# EAGLE schematic WZ8048C070-V1.1-20230407 (EAGLE 9.6.2)
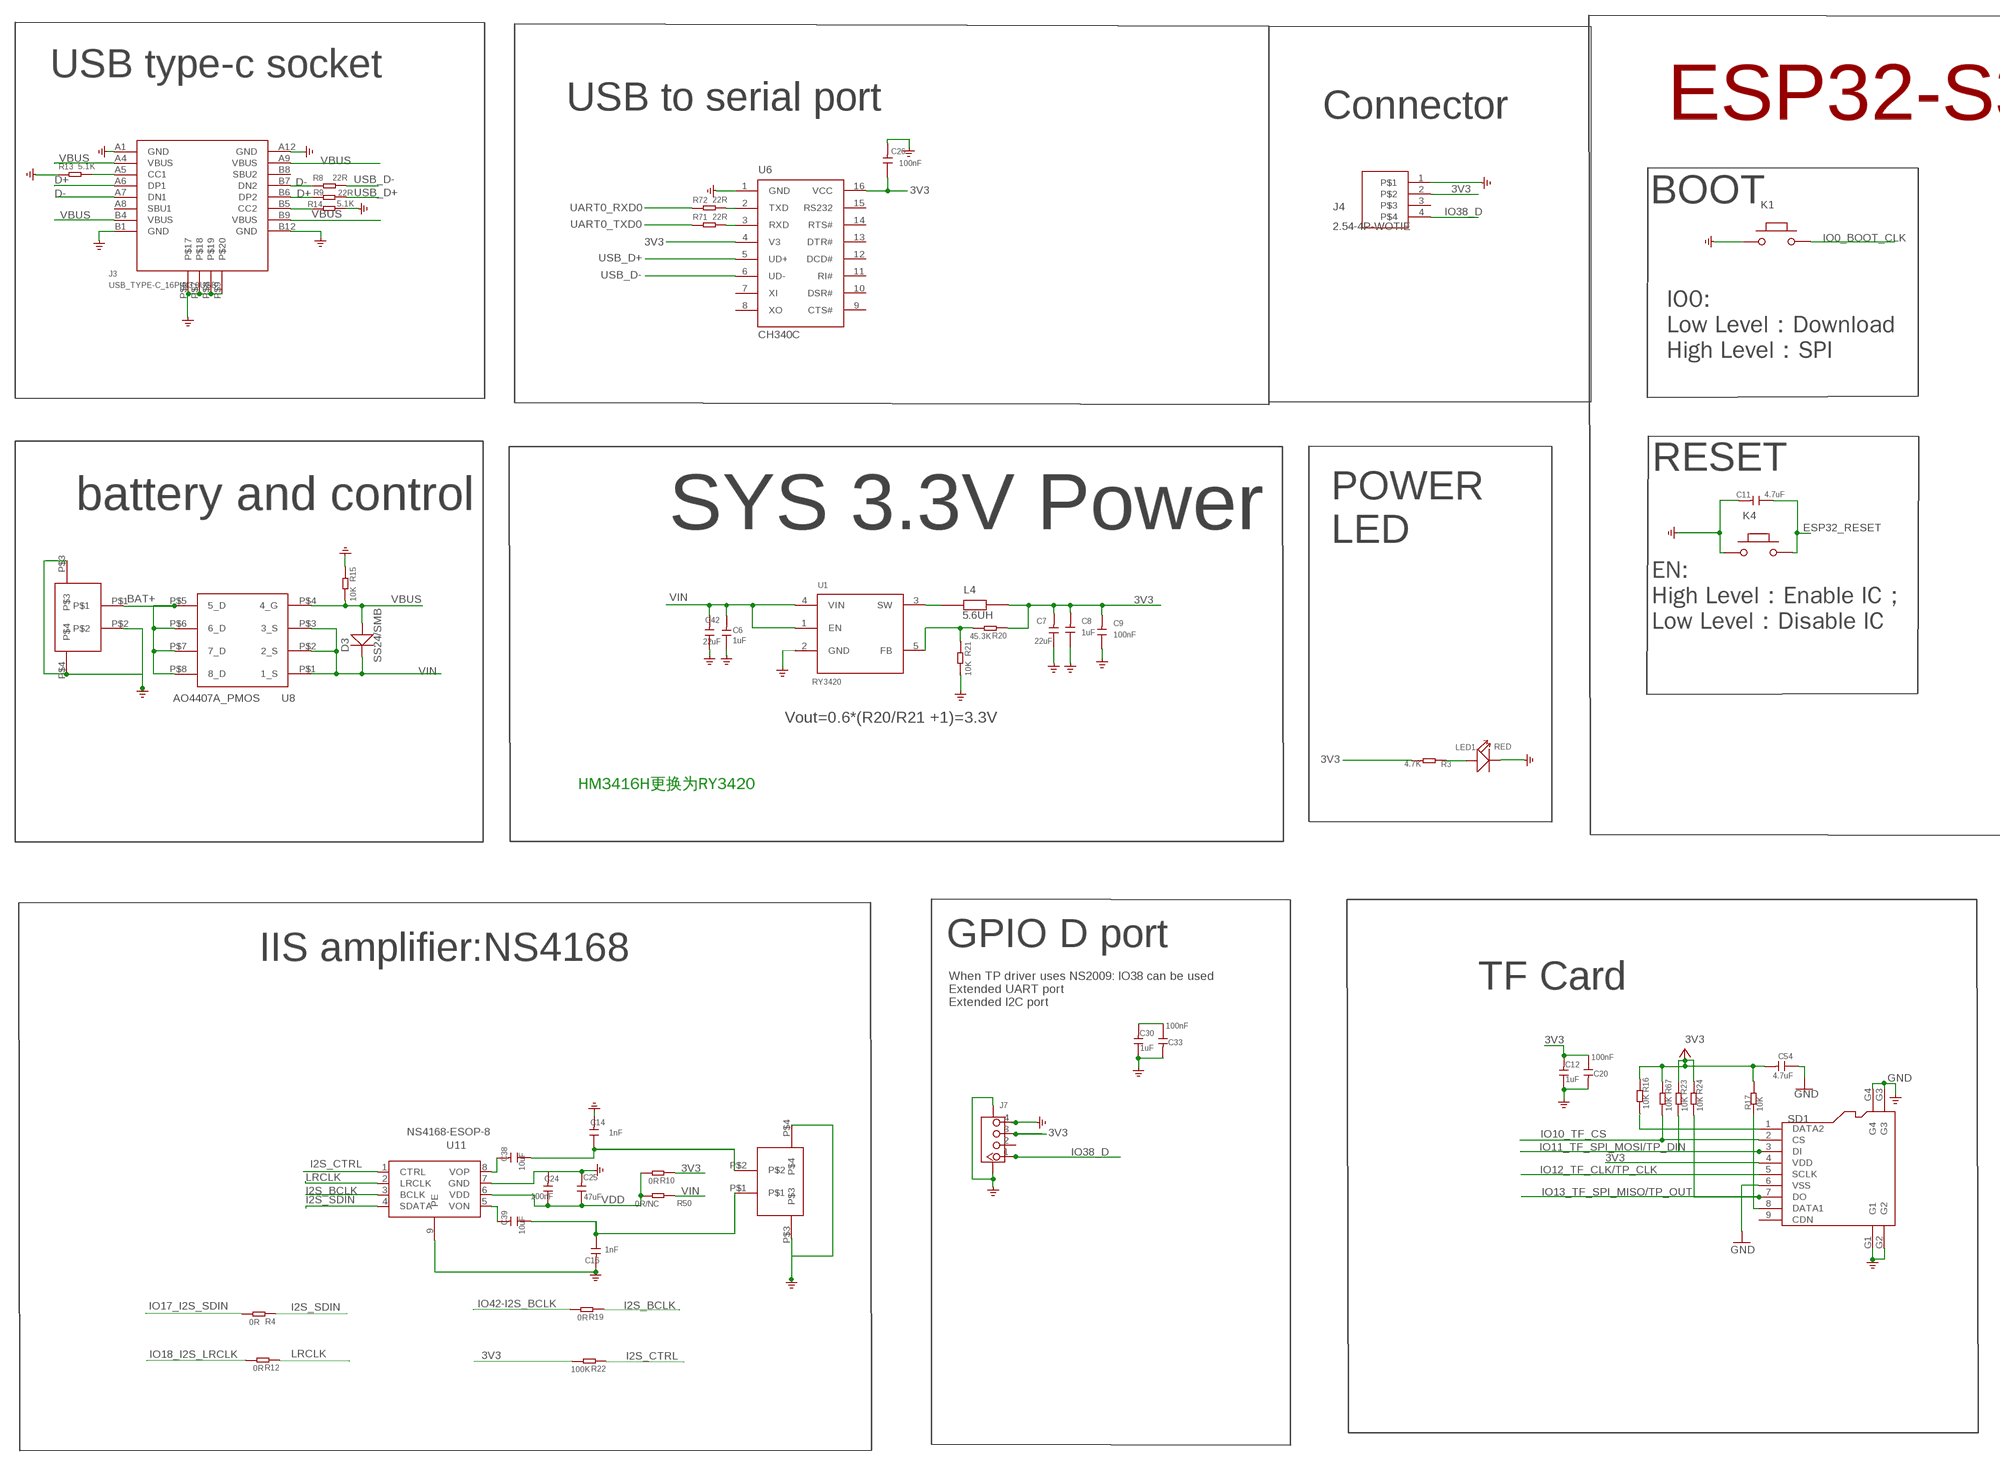
[diagram p0: schematic, sheet 1, part 1 of 2]
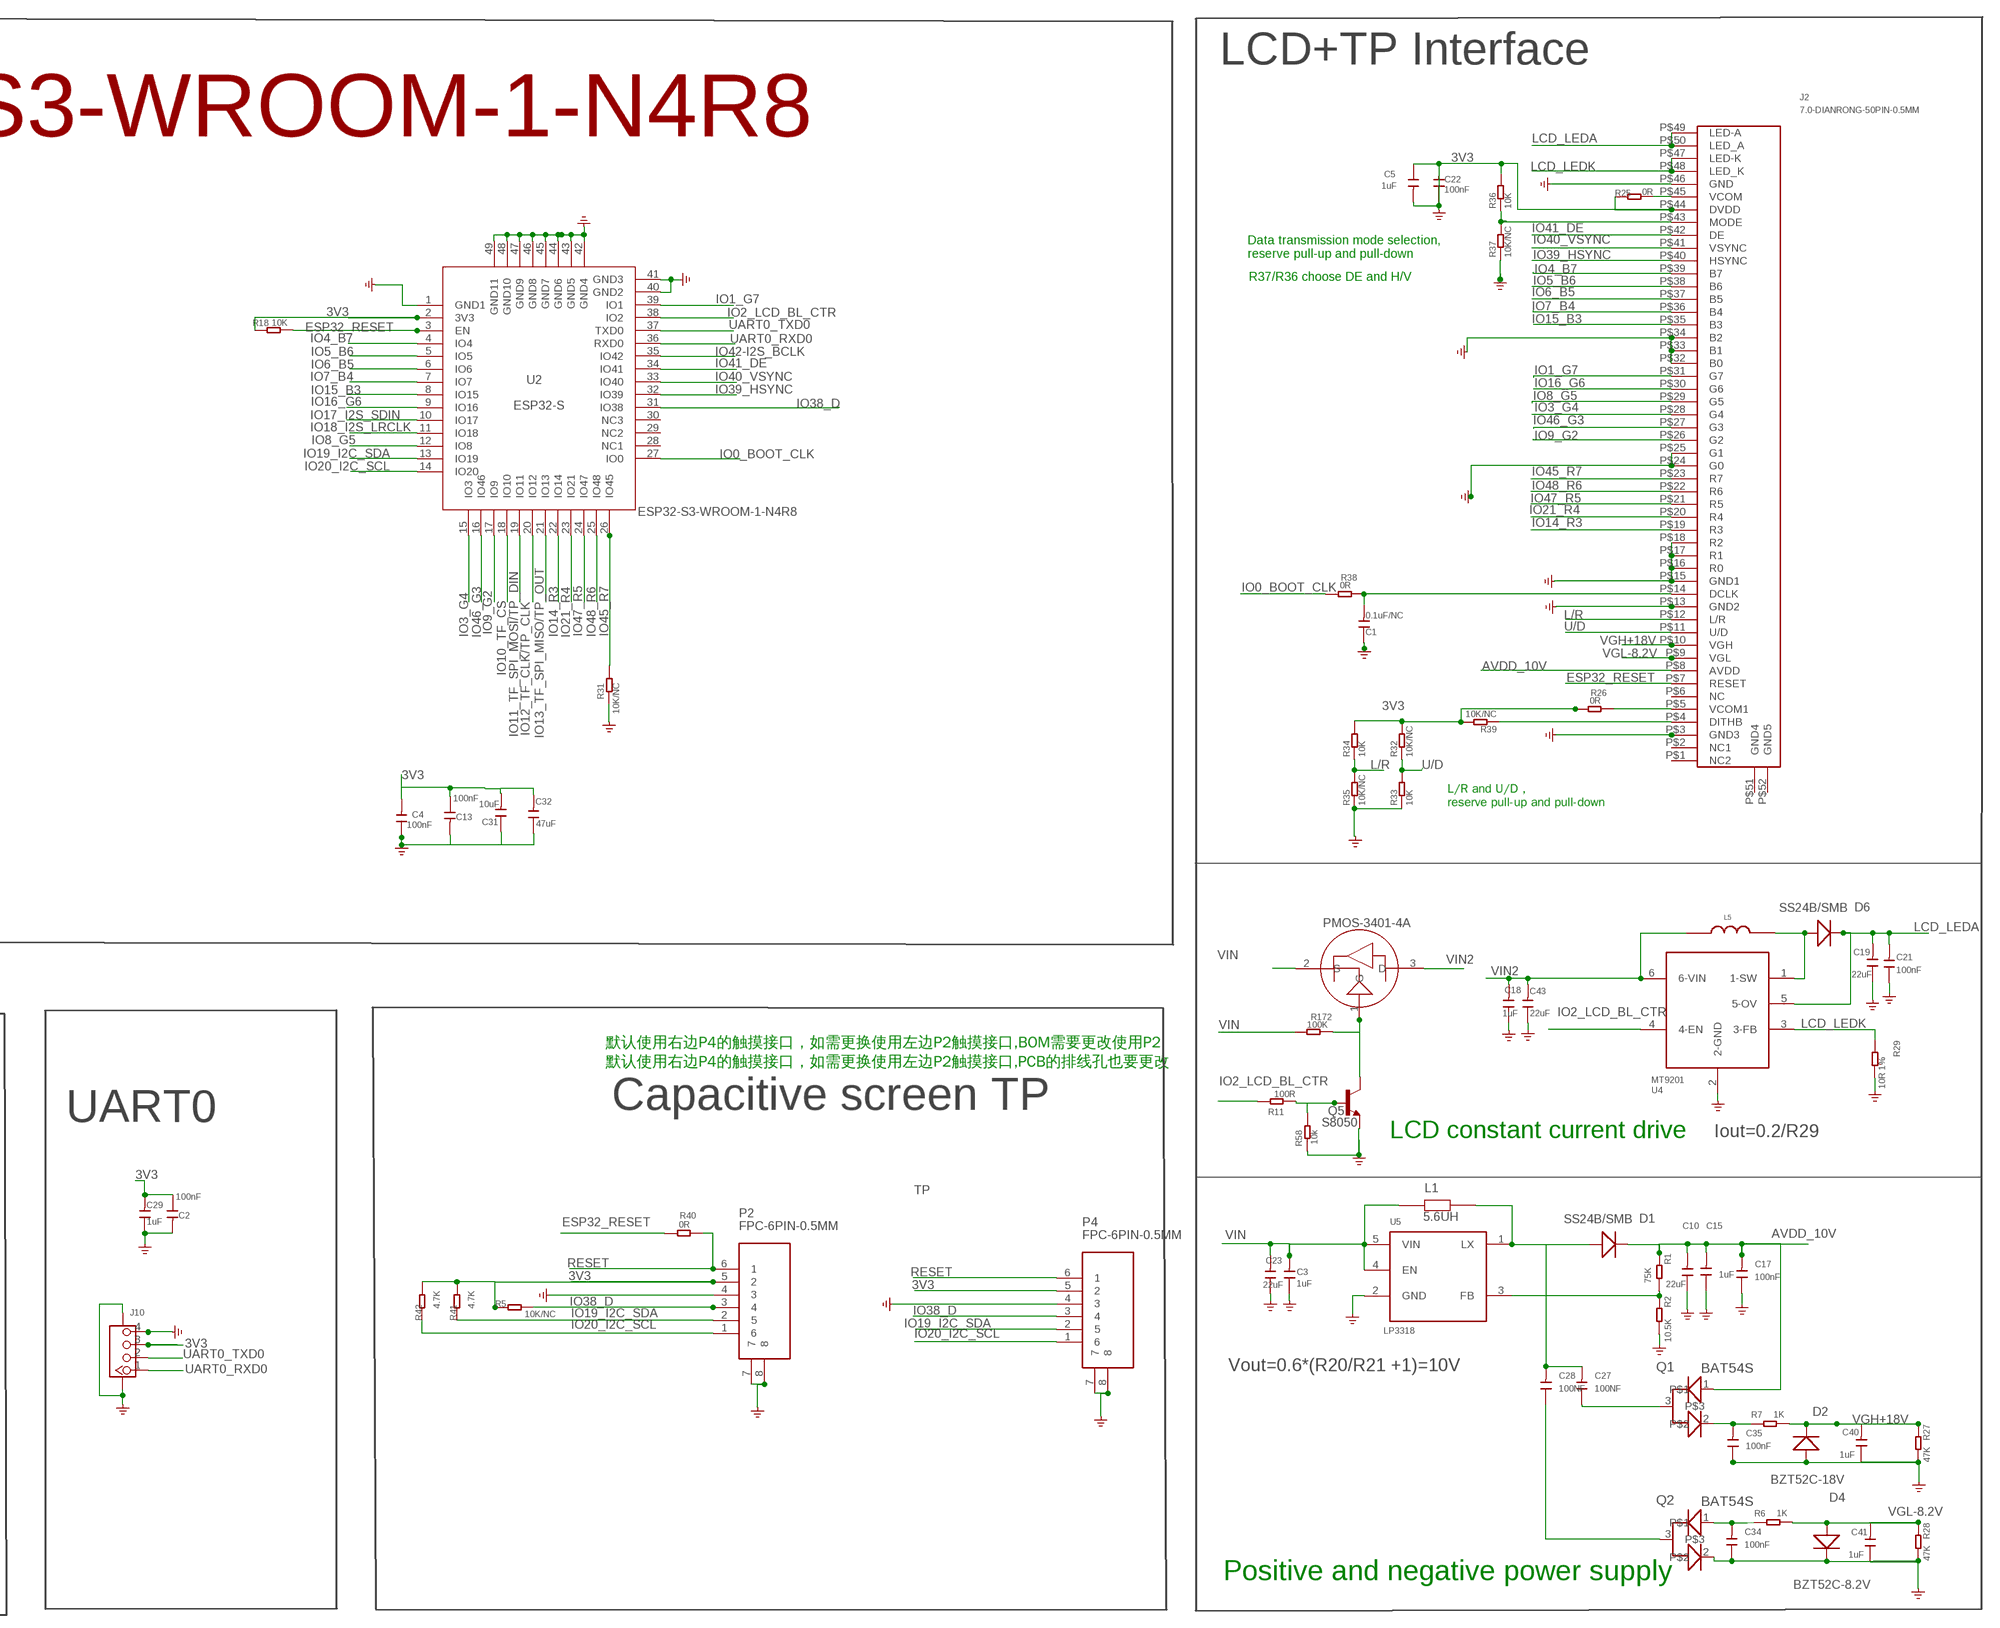
[diagram p1: schematic, sheet 1, part 2 of 2]

## Parts
C1  0.1uF/NC  DISCRETE_C-0603  [DISCRETE_C0603]
C2  100nF  C-0603  [C0603]
C3  1uF  C0603  [0603]
C4  100nF  C-0603  [C0603]
C5  1uF  C-0603  [C0603]
C6  1uF  C0603  [0603]
C7  22uF  C0805  [0805]
C8  1uF  C0603  [0603]
C9  100nF  C0603  [0603]
C10  22uF  C0805  [0805]
C11  4.7uF  C0603  [0603]
C12  1uF  DISCRETE_C-0603  [DISCRETE_C0603]
C13  100nF  C-0603  [C0603]
C14  1nF  C-0603  [C0603]
C15  1uF  C0603  [0603]
C16  1nF  C-0603  [C0603]
C17  100nF  C0603  [0603]
C18  1uF  C0603  [0603]
C19  22uF  C0805  [0805]
C20  100nF  C-0603  [C0603]
C21  100nF  C0603  [0603]
C22  100nF  C-0603  [C0603]
C23  22uF  C0805  [0805]
C24  100nF  C-0603  [C0603]
C25  47uF  C0805  [0805]
C26  100nF  C0603  [0603]
C27  100NF  C0603  [0603]
C28  100NF  C0603  [0603]
C29  1uF  DISCRETE_C-0603  [DISCRETE_C0603]
C30  1uF  DISCRETE_C-0603  [DISCRETE_C0603]
C31  10uF  DISCRETE_C-0603  [DISCRETE_C0603]
C32  47uF  C0805  [0805]
C33  100nF  C-0603  [C0603]
C34  100nF  C0603  [0603]
C35  100nF  C0603  [0603]
C38  10uF  C-0603  [C0603]
C39  10uF  C-0603  [C0603]
C40  1uF  C0805  [0805]
C41  1uF  C0805  [0805]
C42  22uF  C0805  [0805]
C43  22uF  C0805  [0805]
C54  4.7uF  DISCRETE_C-0603  [DISCRETE_C0603]
D1  SS24B/SMB  214ABDO-214AB  [214AB]
D2  BZT52C-18V  DISCRETE_D1206  [DISCRETE_SOD123]
D3  SS24/SMB  214ABDO-214AB  [214AB]
D4  BZT52C-8.2V  DISCRETE_D1206  [DISCRETE_SOD123]
D6  SS24B/SMB  214ABDO-214AB  [214AB]
J1  PH2.0WT-2PIN  [PH2.0WT-2PIN]
J2  7.0-DIANRONG-50PIN-0.5MM  [7.0-DAINRONG-50PIN-0.5MM]
J3  USB_TYPE-C_16PIN3.0USB  [KEVIN_3.0TYPEC-SMD]
J4  2.54-4P-WOTIE  [2.54-4P-WOTIE]
J5  PH2.0WT-2PIN  [PH2.0WT-2PIN]
J7  CONNECTOR_TWIG-4P-2.0-SMD-FEMALE-REINFORCE90D  [CONNECTOR_4P-SMD-2.0-90D]
J10  CONNECTOR_TWIG-4P-2.0-SMD-FEMALE-REINFORCE90D  [CONNECTOR_4P-SMD-2.0-90D]
K1  BUTTON  PB157  [157SW]
K4  BUTTON  PB157  [157SW]
L1  5.6UH  CROWPI2-MB-V1.4-20211012_CMP201209UD1R0MT  [CD54]
L4  5.6UH  CROWPI2-MB-V1.4-20211012_CMP201209UD1R0MT  [CD54]
L5  CD32_6.8uH  CD32_950MA  [CD32]
LED1  RED  DISCRETE_LED0603  [DISCRETE_LED-0603]
P2  FPC-6PIN-0.5MM  [FPC-6PIN-0.5MM]
P4  FPC-6PIN-0.5MM  [FPC-6PIN-0.5MM]
Q1  BAT54S  [SOT23-3]
Q2  BAT54S  [SOT23-3]
Q5  S8050  SPARKFUN_TRANSISTOR_NPNSOT23  [SPARKFUN_SOT23]
Q30  PMOS-3401-4A  P-MOS-SOT23  [SOT-23]
R1  75K  DISCRETE_R-0603  [DISCRETE_R0603]
R2  10.5K  DISCRETE_R-0603  [DISCRETE_R0603]
R3  4.7K  DISCRETE_R-0603  [DISCRETE_R0603]
R4  0R  DISCRETE_R-0603  [DISCRETE_R0603]
R5  10K/NC  DISCRETE_R-0603  [DISCRETE_R0603]
R6  1K  DISCRETE_R-0603  [DISCRETE_R0603]
R7  1K  DISCRETE_R-0603  [DISCRETE_R0603]
R8  22R  DISCRETE_R-0603  [DISCRETE_R0603]
R9  22R  DISCRETE_R-0603  [DISCRETE_R0603]
R10  0R  DISCRETE_R-0603  [DISCRETE_R0603]
R11  100R  R0603  [R0603]
R12  0R  DISCRETE_R-0603  [DISCRETE_R0603]
R13  5.1K  DISCRETE_R-0603  [DISCRETE_R0603]
R14  5.1K  DISCRETE_R-0603  [DISCRETE_R0603]
R15  10K  DISCRETE_R-0603  [DISCRETE_R0603]
R16  10K  DISCRETE_R-0603  [DISCRETE_R0603]
R17  10K  DISCRETE_R-0603  [DISCRETE_R0603]
R18  10K  DISCRETE_R-0603  [DISCRETE_R0603]
R19  0R  DISCRETE_R-0603  [DISCRETE_R0603]
R20  45.3K  DISCRETE_R-0603  [DISCRETE_R0603]
R21  10K  DISCRETE_R-0603  [DISCRETE_R0603]
R22  100K  DISCRETE_R-0603  [DISCRETE_R0603]
R23  10K  DISCRETE_R-0603  [DISCRETE_R0603]
R24  10K  DISCRETE_R-0603  [DISCRETE_R0603]
R25  0R  DISCRETE_R-0603  [DISCRETE_R0603]
R26  0R  R-0603  [R0603]
R27  47K  DISCRETE_R-0603  [DISCRETE_R0603]
R28  47K  DISCRETE_R-0603  [DISCRETE_R0603]
R29  10R 1%  DISCRETE_R-0603  [DISCRETE_R0603]
R31  10K/NC  R0603  [R0603]
R32  10K/NC  DISCRETE_R-0603  [DISCRETE_R0603]
R33  10K  DISCRETE_R-0603  [DISCRETE_R0603]
R34  10K  DISCRETE_R-0603  [DISCRETE_R0603]
R35  10K/NC  DISCRETE_R-0603  [DISCRETE_R0603]
R36  10K  DISCRETE_R-0603  [DISCRETE_R0603]
R37  10K/NC  DISCRETE_R-0603  [DISCRETE_R0603]
R38  0R  R-0603  [R0603]
R39  10K/NC  DISCRETE_R-0603  [DISCRETE_R0603]
R40  0R  R-0603  [R0603]
R41  4.7K  DISCRETE_R-0603  [DISCRETE_R0603]
R42  4.7K  DISCRETE_R-0603  [DISCRETE_R0603]
R50  0R/NC  DISCRETE_R-0603  [DISCRETE_R0603]
R58  10k  R0603  [R0603]
R67  10K  DISCRETE_R-0603  [DISCRETE_R0603]
R71  22R  DISCRETE_R-0603  [DISCRETE_R0603]
R72  22R  DISCRETE_R-0603  [DISCRETE_R0603]
R172  100K  R-0603  [R0603]
SD1  HOLDER-MICROSD-9P  [9P-SMD-W/-RING]
U1  RY3420  A_XBJ_HM3420B  [A_XBJ_SOT23-5]
U2  ESP32-S  [ESP32-S3]
U4  MT9201  [SOT23-6]
U5  LP3318  [LP3318_SOT23-5]
U6  CH340C  CH340G  [SOP-16]
U8  AO4407A_PMOS  T_PMOS_AO4407A_SOP8  [SOP8]
U11  NS4168-ESOP-8  [NS4168-ESOP-8]

## Nets
3V3: C2.1 C4.2 C5.1 C7.2 C8.2 C9.2 C12.2 C13.1 C20.1 C22.2 C26.1 C29.2 C30.2 C31.2 C32.2 C33.1 C54.2 J2.P$44(DVDD) J4.2 J7.3 J10.3 L4.2 P2.5 P4.5 R3.2 R5.1 R10.1 R16.1 R17.1 R18.1 R20.1 R22.2 R23.1 R24.1 R25.1 R26.1 R32.2 R34.2 R36.2 R39.2 R41.2 R42.2 R67.1 SD1.4(VDD) U2.2(3V3) U6.4(V3) U6.16(VCC) ; supply symbol labelled +3V3
AVDD_10V: C10.2 C15.2 C17.2 D1.2(-) J2.P$8(AVDD) Q1.1 R1.1
BAT+: J1.P$1 U8.P$5(5_D) U8.P$6(6_D) U8.P$7(7_D) U8.P$8(8_D)
D+: J3.A6(DP1) J3.B6(DP2) R9.1
D-: J3.A7(DN1) J3.B7(DN2) R8.1
DCLK1: C1.2 J2.P$14(DCLK) R38.2
ESP32_RESET: C11.1 J2.P$7(RESET) K4.2 R18.2 R40.1 U2.3(EN)
GND: C1.1 C2.2 C3.1 C4.1 C5.2 C6.1 C7.1 C8.1 C9.1 C10.1 C11.2 C12.1 C13.2 C14.2 C15.1 C16.2 C17.1 C18.1 C19.1 C20.2 C21.1 C22.1 C23.1 C24.2 C25.2 C26.2 C29.1 C30.1 C31.1 C32.1 C33.2 C34.1 C35.1 C40.1 C41.1 C42.1 C43.1 C54.1 D2.+ D4.- J1.P$2 J1.P$3 J1.P$4 J2.P$3(GND3) J2.P$13(GND2) J2.P$15(GND1) J2.P$16(R0) J2.P$17(R1) J2.P$18(R2) J2.P$24(G0) J2.P$25(G1) J2.P$32(B0) J2.P$33(B1) J2.P$34(B2) J2.P$46(GND) J3.A1(GND) J3.A12(GND) J3.B1(GND) J3.B12(GND) J3.P$6 J3.P$7 J3.P$8 J3.P$9 J4.1 J5.P$3 J5.P$4 J7.4 J7.SS1 J7.SS2 J10.4 J10.SS1 J10.SS2 K1.1 K4.1 LED1.- P2.4 P2.7 P2.8 P4.4 P4.7 P4.8 Q2.2 Q5.2(E) R2.2 R13.1 R14.2 R15.1 R21.2 R27.2 R28.2 R29.2 R31.1 R33.1 R35.1 R37.1 R58.1 SD1.6(VSS) SD1.G1 SD1.G2 SD1.G3 SD1.G4 U1.2(GND) U2.1(GND1) U2.40(GND2) U2.41(GND3) U2.42(GND4) U2.43(GND5) U2.44(GND6) U2.45(GND7) U2.46(GND8) U2.47(GND9) U2.48(GND10) U2.49(GND11) U4.2(2-GND) U5.2(GND) U6.1(GND) U11.7(GND) U11.9(PE)
I2S_BCLK: R19.1 U11.3(BCLK)
I2S_CTRL: R22.1 U11.1(CTRL)
I2S_SDIN: R4.1 U11.4(SDATA)
IO0_BOOT_CLK: K1.2 R38.1 U2.27(IO0)
IO1_G7: J2.P$31(G7) U2.39(IO1)
IO2_LCD_BL_CTR: R11.2 U2.38(IO2) U4.4(4-EN)
IO3_G4: J2.P$28(G4) U2.15(IO3)
IO4_B7: J2.P$39(B7) U2.4(IO4)
IO5_B6: J2.P$38(B6) U2.5(IO5)
IO6_B5: J2.P$37(B5) U2.6(IO6)
IO7_B4: J2.P$36(B4) U2.7(IO7)
IO8_G5: J2.P$29(G5) U2.12(IO8)
IO9_G2: J2.P$26(G2) U2.17(IO9)
IO10_TF_CS: R67.2 SD1.2(CS) U2.18(IO10)
IO11_TF_SPI_MOSI/TP_DIN: R23.2 SD1.3(DI) U2.19(IO11)
IO12_TF_CLK/TP_CLK: SD1.5(SCLK) U2.20(IO12)
IO13_TF_SPI_MISO/TP_OUT: R24.2 SD1.7(DO) U2.21(IO13)
IO14_R3: J2.P$19(R3) U2.22(IO14)
IO15_B3: J2.P$35(B3) U2.8(IO15)
IO16_G6: J2.P$30(G6) U2.9(IO16)
IO17_I2S_SDIN: R4.2 U2.10(IO17)
IO18_I2S_LRCLK: R12.2 U2.11(IO18)
IO19_I2C_SDA: P2.2 P4.2 R41.1 U2.13(IO19)
IO20_I2C_SCL: P2.1 P4.1 R42.1 U2.14(IO20)
IO21_R4: J2.P$20(R4) U2.23(IO21)
IO38_D: J4.4 J7.1 P2.3 P4.3 R5.2 U2.31(IO38)
IO39_HSYNC: J2.P$40(HSYNC) U2.32(IO39)
IO40_VSYNC: J2.P$41(VSYNC) U2.33(IO40)
IO41_DE: J2.P$42(DE) U2.34(IO41)
IO42-I2S_BCLK: R19.2 U2.35(IO42)
IO45_R7: J2.P$23(R7) R31.2 U2.26(IO45)
IO46_G3: J2.P$27(G3) U2.16(IO46)
IO47_R5: J2.P$21(R5) U2.24(IO47)
IO48_R6: J2.P$22(R6) U2.25(IO48)
L/R: J2.P$12(L/R) R34.1 R35.2
LCD_LEDA: C19.2 C21.2 D6.2(-) J2.P$49(LED-A) J2.P$50(LED_A) U4.5(5-OV)
LCD_LEDK: J2.P$47(LED-K) J2.P$48(LED_K) R29.1 U4.3(3-FB)
LRCLK: R12.1 U11.2(LRCLK)
N$1: LED1.+ R3.1
N$2: J2.P$45(VCOM) R25.2
N$3: C14.1 C38.1 J5.P$2
N$4: J2.P$5(VCOM1) R26.2
N$6: C38.2 U11.8(VOP)
N$7: R1.2 R2.1 U5.3(FB)
N$8: C39.2 U11.5(VON)
N$9: C27.2 C28.2 D1.1(+) L1.2 U5.1(LX)
N$10: C27.1 Q1.3
N$11: J3.A5(CC1) R13.2
N$12: J2.P$43(MODE) R36.1 R37.2
N$13: L4.1 U1.3(SW)
N$14: J2.P$4(DITHB) R39.1
N$15: C16.1 C39.1 J5.P$1
N$16: D6.1(+) L5.2 U4.1(1-SW)
N$17: J3.B5(CC2) R14.1
N$20: R20.2 R21.1 U1.5(FB)
N$23: Q5.1(B) R11.1 R58.2
N$24: C28.1 Q2.3
N$29: C35.2 Q1.2 R7.1
N$30: C34.2 Q2.1 R6.1
N$36: Q5.3(C) Q30.1(G) R172.2
N$40: R72.2 U6.2(TXD)
N$42: R71.2 U6.3(RXD)
N$47: R16.2 SD1.1(DATA2)
N$48: R17.2 SD1.8(DATA1)
RESET: P2.6 P4.6 R40.2
U/D: J2.P$11(U/D) R32.1 R33.2
UART0_RXD0: J10.1 R72.1 U2.36(RXD0)
UART0_TXD0: J10.2 R71.1 U2.37(TXD0)
USB_D+: R9.2 U6.5(UD+)
USB_D-: R8.2 U6.6(UD-)
VBUS: D3.1(+) J3.A4(VBUS) J3.A9(VBUS) J3.B4(VBUS) J3.B9(VBUS) R15.2 U8.P$4(4_G)
VDD: C24.1 C25.1 R10.2 R50.2 U11.6(VDD)
VGH+18V: C40.2 D2.- J2.P$10(VGH) R7.2 R27.1
VGL-8.2V: C41.2 D4.+ J2.P$9(VGL) R6.2 R28.1
VIN: C3.2 C6.2 C23.2 C42.2 D3.2(-) L1.1 Q30.2(S) R50.1 R172.1 U1.1(EN) U1.4(VIN) U5.4(EN) U5.5(VIN) U8.P$1(1_S) U8.P$2(2_S) U8.P$3(3_S)
VIN2: C18.2 C43.2 L5.1 Q30.3(D) U4.6(6-VIN)
Unconnected: J2.P$1(NC2) J2.P$2(NC1) J2.P$6(NC) J2.P$51(GND4) J2.P$52(GND5) J3.A8(SBU1) J3.B8(SBU2) J4.3 J7.2 SD1.9(CDN) U2.28(NC1) U2.29(NC2) U2.30(NC3) U6.7(XI) U6.8(XO) U6.9(CTS#) U6.10(DSR#) U6.11(RI#) U6.12(DCD#) U6.13(DTR#) U6.14(RTS#) U6.15(RS232)

## Notes on the sheet
- LCD+TP Interface
- USB type-c socket
- USB to serial port | Connector | ESP32-S3-WROOM-1-N4R8
- BOOT
- Data transmission mode selection, 
  reserve pull-up and pull-down
- R37/R36 choose DE and H/V
- IO0:
  Low Level：Download
  High Level：SPI
- RESET
- battery and control
- SYS 3.3V Power
- POWER
  LED
- EN:
  High Level：Enable IC；
  Low Level：Disable IC
- L/R and U/D，
  reserve pull-up and pull-down
- Vout=0.6*(R20/R21 +1)=3.3V
- HM3416H更换为RY3420
- 默认使用右边P4的触摸接口，如需更换使用左边P2触摸接口,BOM需要更改使用P2
- GPIO D port | 默认使用右边P4的触摸接口，如需更换使用左边P2触摸接口,PCB的排线孔也要更改
- IIS amplifier:NS4168
- TF Card | UART0 | Capacitive screen TP
- When TP driver uses NS2009: IO38 can be used
  Extended UART port
  Extended I2C port
- LCD constant current drive | Iout=0.2/R29
- TP
- Vout=0.6*(R20/R21 +1)=10V
- Positive and negative power supply

## Library data of the parts
C1 C31 C54 = A9G:DISCRETE_C*: Ceramic Capacitors
C2 C4 C5 C13 C14 C16 C20 C22 C24 C33 C38 C39 = discrete:C*: Ceramic Capacitors
C3 C6 C8 C9 C11 C15 C17 C18 C21 C26-C28 C34 C35 = A_xbj:C0603
C7 C10 C19 C23 C25 C32 C40-C43 = A_xbj:C0805
C12 C29 C30 = A_xbj:DISCRETE_C*: Ceramic Capacitors
D1 D3 D6 = DO-214AB:214AB: 214AB
D2 D4 = cooper:DISCRETE_D*
J1 J5 = cooper:PH2.0WT-2PIN
J2 = cooper:7.0-DIANRONG-50PIN-0.5MM
J3 = WZ3532R024-ESP32-V0.1-20221226:USB_TYPE-C_16PIN
J4 = cooper:2.54-4P-WOTIE
J7 J10 = A_xbj:CONNECTOR_TWIG-4P-2.0-SMD-FEMALE-REINFORCE
K1 K4 = MySMD:PB157
L1 L4 = CD54:CROWPI2-MB-V1.4-20211012_CMP201209UD1R0MT
L5 = CD54:CD32_950MA
LED1 = A_xbj:DISCRETE_LED*
P2 P4 = cooper:FPC-6PIN-0.5MM
Q1 Q2 = cooper:BAT54S
Q5 = Adafruit_HUZZAH32_ESP32_Feather:SPARKFUN_TRANSISTOR_NPN: Transistor NPN BJT configuration in SOT23 package. MMBT2222 is the common NPN we use. Double check BCE configuration again layout.
Q30 = DFN8:P-MOS-SOT23
R1-R10 R12-R25 R27-R29 R41 R42 R50 R67 R71 R72 = Crowtail-_LED-V2.0-20190615-01:DISCRETE_R*
R11 R31 R58 = cooper:R0603
R26 R38 R40 R172 = discrete:R*
R32-R37 R39 = A9G:DISCRETE_R*
SD1 = Connector:HOLDER-MICROSD-9P
U1 = CrowBot_-V1.0-20220525:A_XBJ_HM3420B
U2 = DW1000:ESP32-S; U2: ESP32-S3-WROOM-1-N4R8
U4 = cooper:MT9201
U5 = cooper:LP3318
U6 = A_xbj:CH340G
U8 = cooper:T_PMOS_AO4407A_SOP8
U11 = STC_MCUSTC8G1K08A:NS4168-ESOP-8

## Net classes
0 default: width 0.152 mm, drill 0.152 mm, clearance 0.152 mm